# EAGLE schematic Model-Train-Controller (EAGLE 9.6.2)
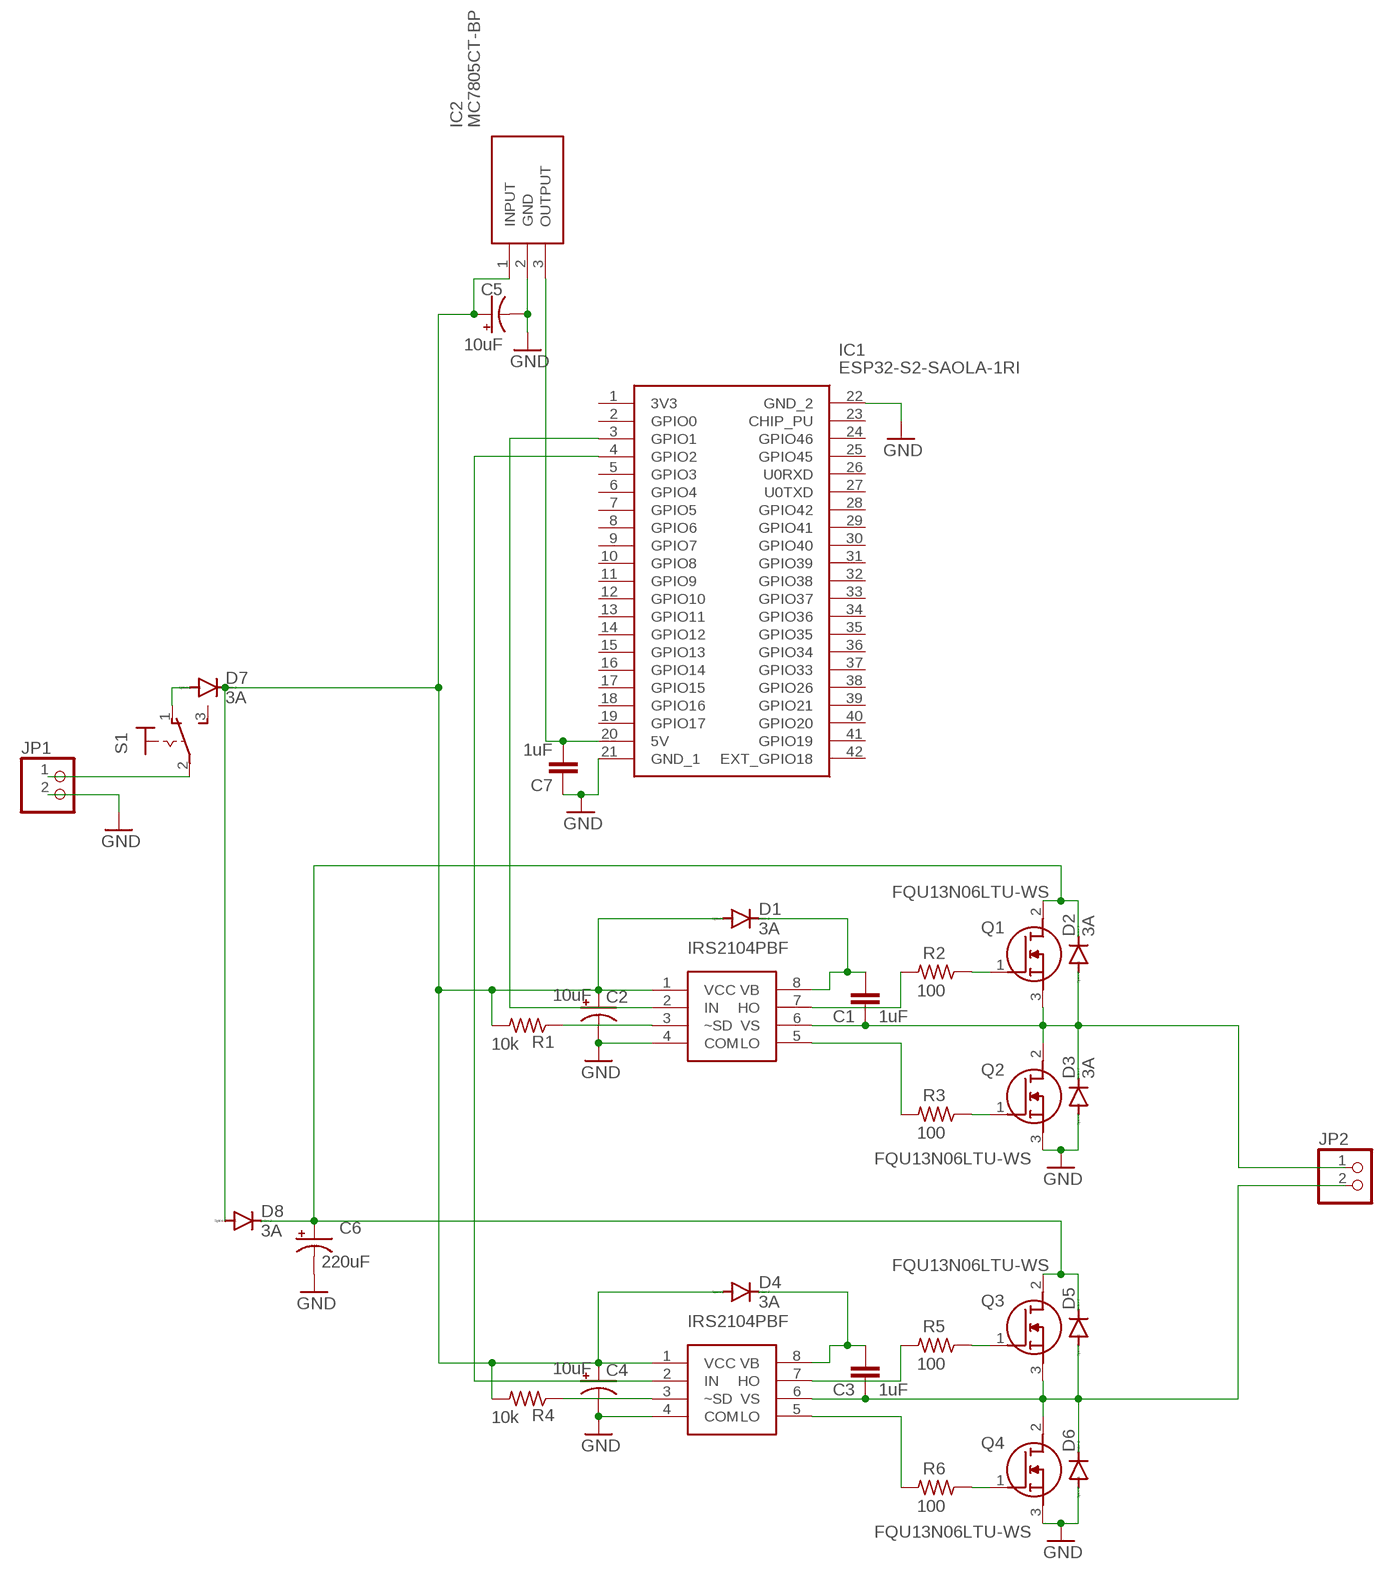
[diagram p0: schematic, sheet 1]

## Parts
C1  1uF  C-EU025-030X050  [C025-030X050]
C2  10uF  CPOL-USE2-5  [E2-5]
C3  1uF  C-EU025-030X050  [C025-030X050]
C4  10uF  CPOL-USE2-5  [E2-5]
C5  10uF  CPOL-USE2-5  [E2-5]
C6  220uF  CPOL-USE2-5  [E2-5]
C7  1uF  C-EU025-030X050  [C025-030X050]
D1  3A  DIODE-DO201-15  [DO201-15]
D2  3A  DIODE-DO201-15  [DO201-15]
D3  3A  DIODE-DO201-15  [DO201-15]
D4  3A  DIODE-DO201-15  [DO201-15]
D5  DIODE-DO201-15  [DO201-15]
D6  DIODE-DO201-15  [DO201-15]
D7  3A  DIODE-DO201-15  [DO201-15]
D8  3A  DIODE-DO201-15  [DO201-15]
IC1  ESP32-S2-SAOLA-1RI  [ESP32S2SAOLA1RI]
IC2  MC7805CT-BP  [TO254P482X1016X2325-3P]
JP1  PINHD-1X2  [1X02]
JP2  PINHD-1X2  [1X02]
Q1  FQU13N06LTU-WS  [TO229P250X658X985-3P]
Q2  FQU13N06LTU-WS  [TO229P250X658X985-3P]
Q3  FQU13N06LTU-WS  [TO229P250X658X985-3P]
Q4  FQU13N06LTU-WS  [TO229P250X658X985-3P]
R1  10k  R-US_0204/5  [0204/5]
R2  100  R-US_0204/5  [0204/5]
R3  100  R-US_0204/5  [0204/5]
R4  10k  R-US_0204/5  [0204/5]
R5  100  R-US_0204/5  [0204/5]
R6  100  R-US_0204/5  [0204/5]
S1  320-916  [320-916]
U$1  IRS2104PBF  [DIL08]
U$2  IRS2104PBF  [DIL08]

## Nets
5V: C7.2 IC1.20(5V) IC2.3(OUTPUT)
GND: C2.- C4.- C5.- C6.- C7.1 D3.A D6.A IC1.21(GND_1) IC1.22(GND_2) IC2.2(GND) JP1.2 Q2.3(S) Q4.3(S) U$1.4(COM) U$2.4(COM)
GPIO1: IC1.3(GPIO1) U$1.2(IN)
GPIO2: IC1.4(GPIO2) U$2.2(IN)
HO1: R2.2 U$1.7(HO)
HO2: R5.2 U$2.7(HO)
LO1: R3.2 U$1.5(LO)
LO2: R6.2 U$2.5(LO)
VB1: C1.2 D1.C U$1.8(VB)
VB2: C3.2 D4.C U$2.8(VB)
VCC: C2.+ C4.+ C5.+ D1.A D4.A D7.C D8.A IC2.1(INPUT) R1.2 R4.2 U$1.1(VCC) U$2.1(VCC)
VGATE1: Q1.1(G) R2.1
VGATE2: Q2.1(G) R3.1
VGATE3: Q3.1(G) R5.1
VGATE4: Q4.1(G) R6.1
VIN: JP1.1 S1.2(P)
VLOAD: C6.+ D2.C D5.C D8.C Q1.2(D) Q3.2(D)
VS1: C1.1 D2.A D3.C JP2.1 Q1.3(S) Q2.2(D) U$1.6(VS)
VS2: C3.1 D5.A D6.C JP2.2 Q3.3(S) Q4.2(D) U$2.6(VS)
VSWITCH: D7.A S1.1(O)
~SD1: R1.1 U$1.3(~SD)
~SD2: R4.1 U$2.3(~SD)
Unconnected: IC1.1(3V3) IC1.2(GPIO0) IC1.5(GPIO3) IC1.6(GPIO4) IC1.7(GPIO5) IC1.8(GPIO6) IC1.9(GPIO7) IC1.10(GPIO8) IC1.11(GPIO9) IC1.12(GPIO10) IC1.13(GPIO11) IC1.14(GPIO12) IC1.15(GPIO13) IC1.16(GPIO14) IC1.17(GPIO15) IC1.18(GPIO16) IC1.19(GPIO17) IC1.23(CHIP_PU) IC1.24(GPIO46) IC1.25(GPIO45) IC1.26(U0RXD) IC1.27(U0TXD) IC1.28(GPIO42) IC1.29(GPIO41) IC1.30(GPIO40) IC1.31(GPIO39) IC1.32(GPIO38) IC1.33(GPIO37) IC1.34(GPIO36) IC1.35(GPIO35) IC1.36(GPIO34) IC1.37(GPIO33) IC1.38(GPIO26) IC1.39(GPIO21) IC1.40(GPIO20) IC1.41(GPIO19) IC1.42(EXT_GPIO18) S1.3(S)

## Library data of the parts
C1 C3 C7 = rcl:C-EU: CAPACITOR, European symbol; SPICEPREFIX: C
C2 C4-C6 = rcl:CPOL-US: POLARIZED CAPACITOR, American symbol; SPICEPREFIX: C
D1-D8 = diode:DIODE-: DIODE
IC1 = ESP32-S2-Saola-1RI:ESP32-S2-SAOLA-1RI: WiFi Development Tools (802.11) ESP32-S2 general-purpose development board, embeds ESP32-S2-WROVER-I, 4 MB flash, with pin header Source: Datasheet <https://docs.espressif.com/projects/esp-idf/en/latest/esp32s2/hw-reference/esp32s2/user-guide-saola-1-v1.2.html>; DESCRIPTION: WiFi Development Tools (802.11) ESP32-S2 general-purpose development board, embeds ESP32-S2-WROVER-I, 4 MB flash, with pin header; HEIGHT: 4mm; MANUFACTURER_NAME: Espressif Systems; MANUFACTURER_PART_NUMBER: ESP32-S2-Saola-1RI; MOUSER_PART_NUMBER: 356-ESP32-S2SAOLA1RI; MOUSER_PRICE-STOCK: https://www.mouser.co.uk/ProductDetail/Espressif-Systems/ESP32-S2-Saola-1RI?qs=OlC7AqGiEDlnUeW3mUDbcw%3D%3D
IC2 = MC7805CT-BP:MC7805CT-BP: MICRO COMMERCIAL COMPONENTS - MC7805CT-BP - LDO, 2VDO, 1A, 5V, 3TO220 Source: Datasheet <https://componentsearchengine.com/Datasheets/2/MC7805CT-BP.pdf>; ARROW_PART_NUMBER: MC7805CT-BP; ARROW_PRICE-STOCK: https://www.arrow.com/en/products/mc7805ct-bp/micro-commercial-components; DESCRIPTION: MICRO COMMERCIAL COMPONENTS - MC7805CT-BP - LDO, 2VDO, 1A, 5V, 3TO220; HEIGHT: 4.82mm; MANUFACTURER_NAME: Micro Commercial Components (MCC); MANUFACTURER_PART_NUMBER: MC7805CT-BP; MOUSER_PART_NUMBER: 833-MC7805CT-BP; MOUSER_PRICE-STOCK: https://www.mouser.co.uk/ProductDetail/Micro-Commercial-Components-MCC/MC7805CT-BP?qs=SdqRYZZ9IxChYPR4%2FIgmYA%3D%3D
JP1 JP2 = pinhead:PINHD-1X2: PIN HEADER
Q1-Q4 = FQU13N06LTU-WS:FQU13N06LTU-WS: FQD13N06L / FQU13N06L N-Channel QFET MOSFET 60 V, 11 A, 115 m Source: Datasheet <https://www.onsemi.com/pub/Collateral/FQU13N06L-D.PDF>; ARROW_PART_NUMBER: FQU13N06LTU-WS; ARROW_PRICE-STOCK: https://www.arrow.com/en/products/fqu13n06ltu-ws/on-semiconductor; DESCRIPTION: FQD13N06L / FQU13N06L N-Channel QFET MOSFET 60 V, 11 A, 115 m; HEIGHT: 2.5mm; MANUFACTURER_NAME: ON Semiconductor; MANUFACTURER_PART_NUMBER: FQU13N06LTU-WS; MOUSER_PART_NUMBER: 512-FQU13N06LTU_WS; MOUSER_PRICE-STOCK: https://www.mouser.co.uk/ProductDetail/ON-Semiconductor-Fairchild/FQU13N06LTU-WS?qs=0lQeLiL1qyZxLWosGbjoMQ%3D%3D
R1-R6 = rcl:R-US_: RESISTOR, American symbol; SPICEPREFIX: R
S1 = switch:320-916: TOGGLE SWITCH distributor RS Components
U$1 U$2 = mylib:IRS2104PBF